# EAGLE design apa102 (EAGLE 6.6.0)
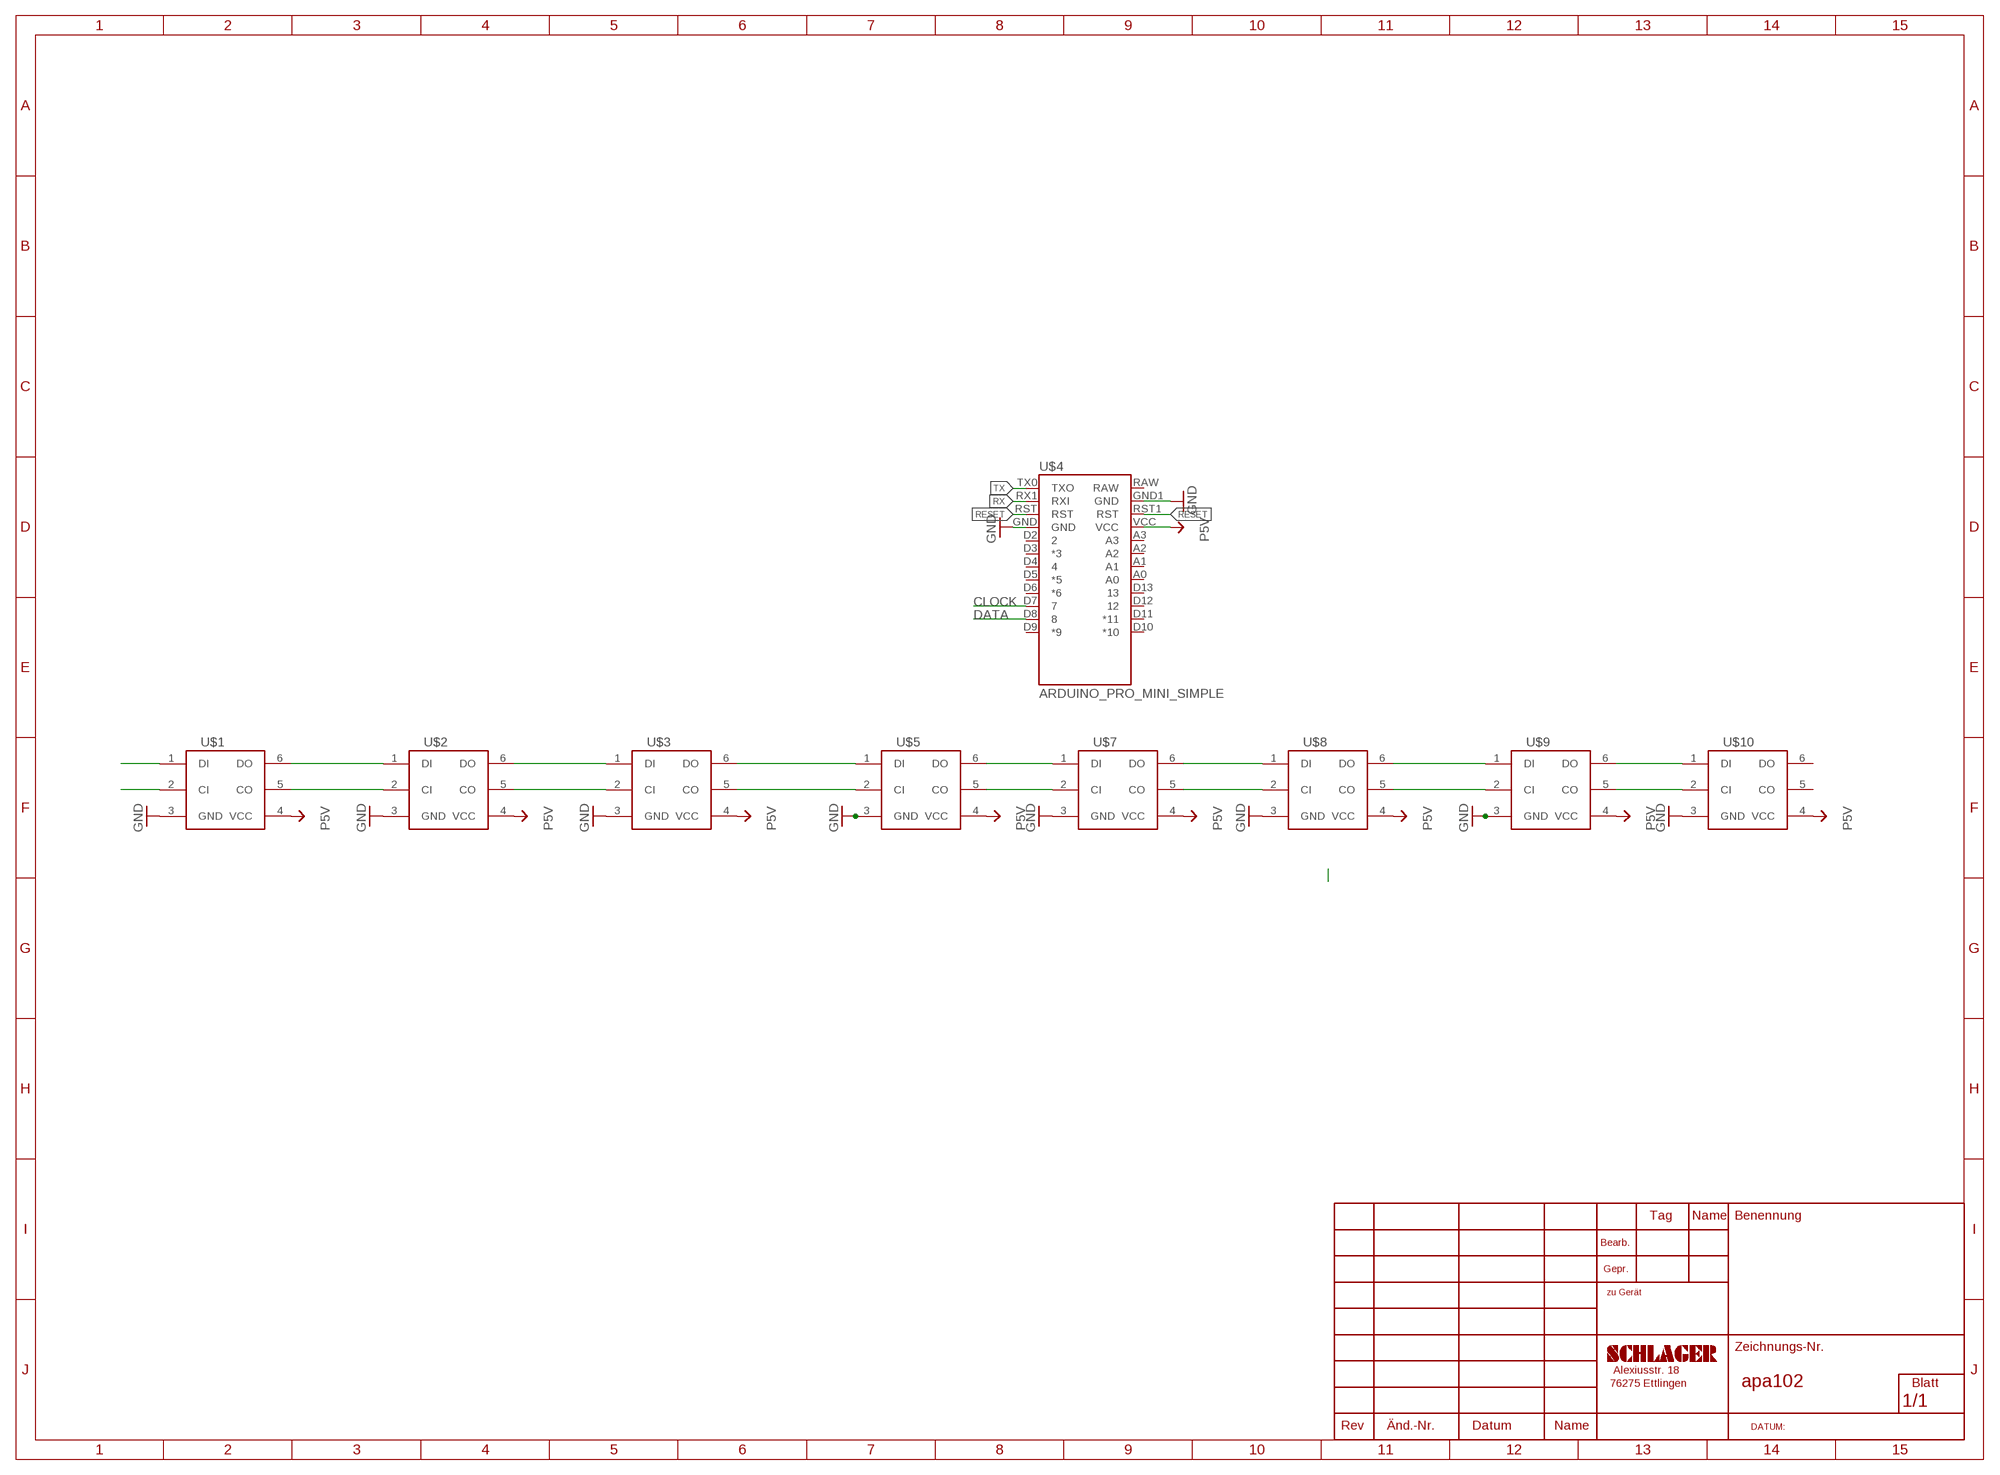
[diagram p0: schematic, sheet 1]

## Parts
U$1  APA102  [LED5050]
U$2  APA102  [LED5050]
U$3  APA102  [LED5050]
U$4  ARDUINO_PRO_MINI_SIMPLE  [PRO_MINI_SIMPLE]
U$5  APA102  [LED5050]
U$7  APA102  [LED5050]
U$8  APA102  [LED5050]
U$9  APA102  [LED5050]
U$10  APA102  [LED5050]

## Nets
CLOCK: U$1.2(CI) U$4.D7
DATA: U$1.1(DI) U$4.D8
GND: U$1.3(GND) U$2.3(GND) U$3.3(GND) U$4.GND U$4.GND1(GND) U$5.3(GND) U$7.3(GND) U$8.3(GND) U$9.3(GND) U$10.3(GND)
N$1: U$1.6(DO) U$2.1(DI)
N$2: U$1.5(CO) U$2.2(CI)
N$3: U$3.6(DO) U$5.1(DI)
N$4: U$2.6(DO) U$3.1(DI)
N$5: U$2.5(CO) U$3.2(CI)
N$6: U$3.5(CO) U$5.2(CI)
N$7: U$5.6(DO) U$7.1(DI)
N$8: U$5.5(CO) U$7.2(CI)
N$9: U$8.6(DO) U$9.1(DI)
N$10: U$7.6(DO) U$8.1(DI)
N$11: U$7.5(CO) U$8.2(CI)
N$12: U$8.5(CO) U$9.2(CI)
N$14: U$9.6(DO) U$10.1(DI)
N$15: U$9.5(CO) U$10.2(CI)
P5V: U$1.4(VCC) U$2.4(VCC) U$3.4(VCC) U$4.VCC U$5.4(VCC) U$7.4(VCC) U$8.4(VCC) U$9.4(VCC) U$10.4(VCC)
RESET: U$4.RST U$4.RST1(RST)
RX: U$4.RX1(RXI)
TX: U$4.TX0(TXO)
Unconnected: U$4.A0 U$4.A1 U$4.A2 U$4.A3 U$4.D2 U$4.D3(*3) U$4.D4 U$4.D5(*5) U$4.D6(*6) U$4.D9(*9) U$4.D10(*10) U$4.D11(*11) U$4.D12 U$4.D13 U$4.RAW U$10.5(CO) U$10.6(DO)

## Library data of the parts
U$1-U$3 U$5 U$7-U$10 = debauer_led:APA102
U$4 = debauer_modules:ARDUINO_PRO_MINI_SIMPLE

## Net classes
4 USBpair: width 0.254 mm, drill 0.406 mm, clearance 0.508 mm

## Board
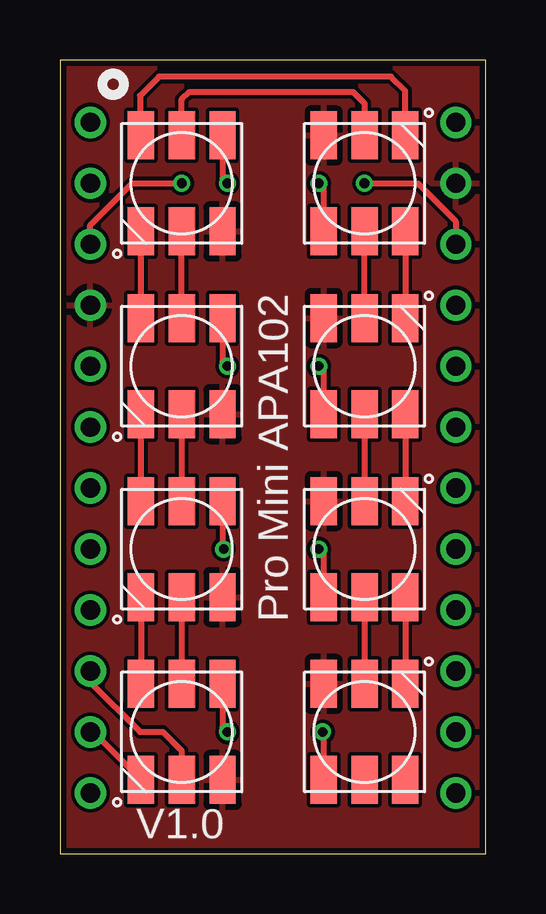
[diagram p1: board, top side]
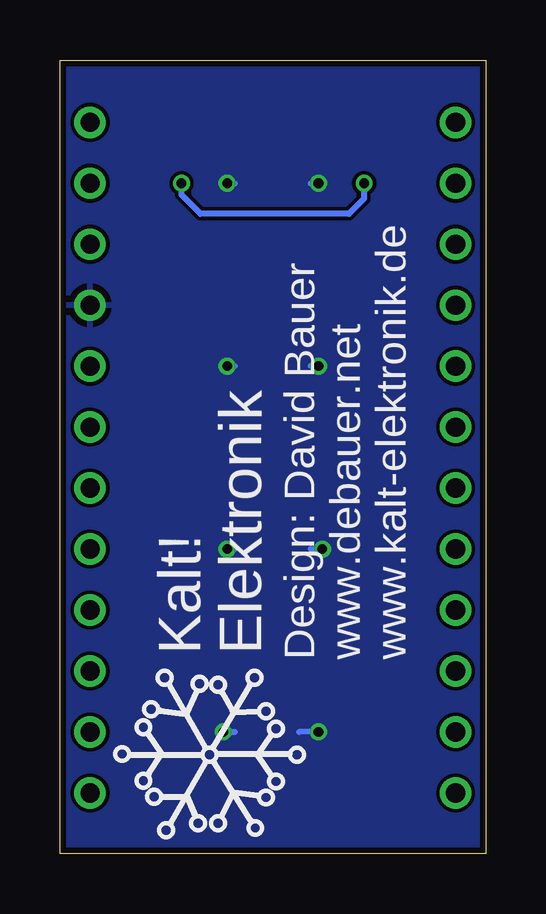
[diagram p2: board, bottom side, seen from below]

Size 17.77 x 33.08 mm. Coordinates in mm from the lower left corner, seen from the top.
Outline: 0,0 17.77,0 17.77,33.08 0,33.08 0,0
Copper layers (1*16): Top 0.035mm / dielectric 1.5mm / Bottom 0.035mm
Design rules "ITEADstudio_DRC": minimum track width 6mil, minimum drill 12mil, track to track 6mil, track to pad 6mil, pad to pad 6mil, via to via 6mil, smd to smd 0mil, copper to edge 10mil, drill to drill 10mil, minimum pad ring 10mil, minimum via ring 6mil, stop-mask expansion 2mil, vias tented up to drill 100mil, thermal gap 10mil

### Footprints (pad centres in the part's own frame; a part is rotated, then mirrored left to right if it is on the bottom)
LED5050 = smd 2 x 1.1: 1 -2,1.7; 2 -2,0; 3 -2,-1.7; 4 2,-1.7; 5 2,0; 6 2,1.7
PRO_MINI_SIMPLE = drill 0.8: A0 7.62,3.81; A1 7.62,1.27; A2 7.62,-1.27; A3 7.62,-3.81; D2 -7.62,3.81; D3 -7.62,1.27; D4 -7.62,-1.27; D5 -7.62,-3.81; D6 -7.62,-6.35; D7 -7.62,-8.89; D8 -7.62,-11.43; D9 -7.62,-13.97; D10 7.62,-13.97; D11 7.62,-11.43; D12 7.62,-8.89; D13 7.62,-6.35; GND 7.62,11.43; GND1 -7.62,6.35; RAW 7.62,13.97; RST 7.62,8.89; RST1 -7.62,8.89; RX1 -7.62,11.43; TX0 -7.62,13.97; VCC 7.62,6.35

### Placement (x,y rotation side)
U$1  5.08,5.08 90 top
U$2  5.08,12.7 90 top
U$3  5.08,20.32 90 top
U$4  8.89,16.51 0 top
U$5  5.08,27.94 90 top
U$7  12.7,27.94 270 top
U$8  12.7,20.32 270 top
U$9  12.7,12.7 270 top
U$10  12.7,5.08 270 top
U$12  [KALT!ELEKTRONIK]  11.43,11.43 90 bottom

### Tracks (layer width: path | path; a pad name or v marks a point on that pad's centre or on a via)
CLOCK
  Top 0.254: U$4.D7 1.27,7.14 3.33,5.08 4.29,5.08 5.08,4.29 U$1.2
DATA
  Top 0.254: U$4.D8 1.38,5.08 U$1.1
GND
  pour Top: -2.54,34.29 21.59,34.29 21.59,-1.27 -2.54,-1.27
N$1
  Top 0.254: U$2.1 U$1.6
N$2
  Top 0.254: U$2.2 U$1.5
N$3
  Top 0.254: U$3.6 U$5.1
N$4
  Top 0.254: U$2.6 U$3.1
N$5
  Top 0.254: U$3.2 U$2.5
N$6
  Top 0.254: U$3.5 U$5.2
N$7
  Top 0.254: U$7.1 14.4,31.8 13.81,32.38 4.13,32.38 3.33,31.59 3.33,29.99 U$5.6
N$8
  Top 0.254: U$5.5 5.08,31.43 5.4,31.75 12.22,31.75 12.7,31.27 U$7.2
N$9
  Top 0.254: U$8.6 U$9.1
N$10
  Top 0.254: U$7.6 U$8.1
N$11
  Top 0.254: U$8.2 U$7.5
N$12
  Top 0.254: U$8.5 U$9.2
N$14
  Top 0.254: U$9.6 U$10.1
N$15
  Top 0.254: U$9.5 U$10.2
P5V  (via drill 0.4)
  Top 0.254: U$10.4 11,5.03 v10.95,5.08 | U$1.4 6.78,5.29 v6.99,5.08 | U$9.4 11,12.49 v10.79,12.7 | U$2.4 6.78,12.75 v6.83,12.7 | U$8.4 11,20.11 v10.79,20.32 | U$3.4 6.78,20.52 v6.99,20.32 | U$7.4 11,27.73 v10.79,27.94 | U$5.4 6.78,28.14 v6.99,27.94
  Bottom 0.254: v10.95,5.08 10.48,5.08 | v6.99,5.08 7.78,5.08 | v10.79,12.7 10.48,12.7 | v6.83,12.7 7.3,12.7 | v10.79,20.32 10.48,20.32 | v6.99,20.32 7.3,20.32 | v10.79,27.94 10.48,27.94 | v6.99,27.94 7.3,27.94
  pour Bottom: -5.08,36.83 24.13,36.83 24.13,-3.81 -5.08,-3.81
RESET  (via drill 0.4)
  Top 0.254: U$4.RST1 1.27,26.19 3.02,27.94 v5.08,27.94 | v12.7,27.94 14.92,27.94 16.51,26.35 U$4.RST
  Bottom 0.254: v5.08,27.94 5.08,27.3 5.71,26.67 11.91,26.67 12.7,27.46 v12.7,27.94

### Text on the board
tPlace: Pro Mini APA102 | V1.0
bPlace: www.kalt-elektronik.de | www.debauer.net | Design: David Bauer